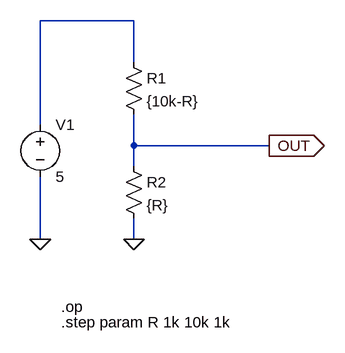
[diagram p0: schematic Draft2.asc]
Draft2.asc, the LTspice schematic file:
Version 4.1
SHEET 1 880 680
WIRE 288 -48 144 -48
WIRE 288 16 288 -48
WIRE 144 112 144 -48
WIRE 288 144 288 96
WIRE 496 144 288 144
WIRE 288 176 288 144
WIRE 144 288 144 192
WIRE 288 288 288 256
FLAG 144 288 0
FLAG 288 288 0
FLAG 496 144 OUT
IOPIN 496 144 Out
SYMBOL voltage 144 96 R0
WINDOW 123 0 0 Left 0
WINDOW 39 0 0 Left 0
SYMATTR InstName V1
SYMATTR Value 5
SYMBOL res 272 0 R0
SYMATTR InstName R1
SYMATTR Value {10k-R}
SYMBOL res 272 160 R0
SYMATTR InstName R2
SYMATTR Value {R}
TEXT 176 416 Left 2 !.step param R 1k 10k 1k
TEXT 176 392 Left 2 !.op

The netlist it stands for:
* Draft2.asc
V1 N001 0 5
R1 N001 OUT {10k-R}
R2 OUT 0 {R}
.step param R 1k 10k 1k
.op
.backanno
.end